# EAGLE schematic elric20-01A (EAGLE 9.5.2)
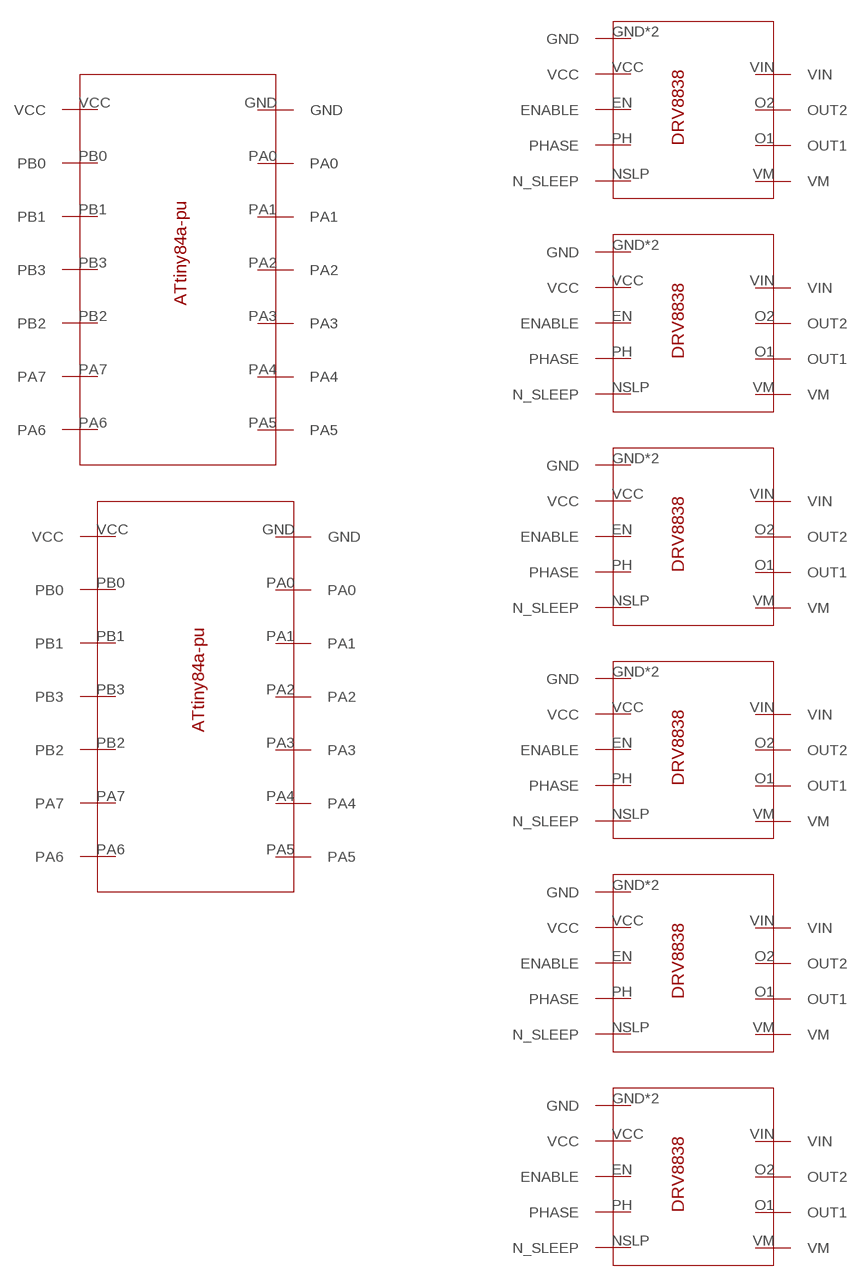
[diagram p0: schematic, sheet 1]

## Parts
U$1  ATTINY84A-PU  [ATTINY84A-PU]
U$2  DRV8838  [DRV8838]
U$3  DRV8838  [DRV8838]
U$4  DRV8838  [DRV8838]
U$5  DRV8838  [DRV8838]
U$6  DRV8838  [DRV8838]
U$7  DRV8838  [DRV8838]
U$8  ATTINY84A-PU  [ATTINY84A-PU]
Unconnected: U$1.GND U$1.PA0 U$1.PA1 U$1.PA2 U$1.PA3 U$1.PA4 U$1.PA5 U$1.PA6 U$1.PA7 U$1.PB0 U$1.PB1 U$1.PB2 U$1.PB3 U$1.VCC U$2.EN(ENABLE) U$2.GND U$2.GND2(GND) U$2.NSLP(N_SLEEP) U$2.O1(OUT1) U$2.O2(OUT2) U$2.PH(PHASE) U$2.VCC U$2.VIN U$2.VM U$3.EN(ENABLE) U$3.GND U$3.GND2(GND) U$3.NSLP(N_SLEEP) U$3.O1(OUT1) U$3.O2(OUT2) U$3.PH(PHASE) U$3.VCC U$3.VIN U$3.VM U$4.EN(ENABLE) U$4.GND U$4.GND2(GND) U$4.NSLP(N_SLEEP) U$4.O1(OUT1) U$4.O2(OUT2) U$4.PH(PHASE) U$4.VCC U$4.VIN U$4.VM U$5.EN(ENABLE) U$5.GND U$5.GND2(GND) U$5.NSLP(N_SLEEP) U$5.O1(OUT1) U$5.O2(OUT2) U$5.PH(PHASE) U$5.VCC U$5.VIN U$5.VM U$6.EN(ENABLE) U$6.GND U$6.GND2(GND) U$6.NSLP(N_SLEEP) U$6.O1(OUT1) U$6.O2(OUT2) U$6.PH(PHASE) U$6.VCC U$6.VIN U$6.VM U$7.EN(ENABLE) U$7.GND U$7.GND2(GND) U$7.NSLP(N_SLEEP) U$7.O1(OUT1) U$7.O2(OUT2) U$7.PH(PHASE) U$7.VCC U$7.VIN U$7.VM U$8.GND U$8.PA0 U$8.PA1 U$8.PA2 U$8.PA3 U$8.PA4 U$8.PA5 U$8.PA6 U$8.PA7 U$8.PB0 U$8.PB1 U$8.PB2 U$8.PB3 U$8.VCC

## Library data of the parts
U$1 U$8 = elric:ATTINY84A-PU
U$2-U$7 = elric:DRV8838